# Altium project 全联供输出板_V1.0.PrjPCB
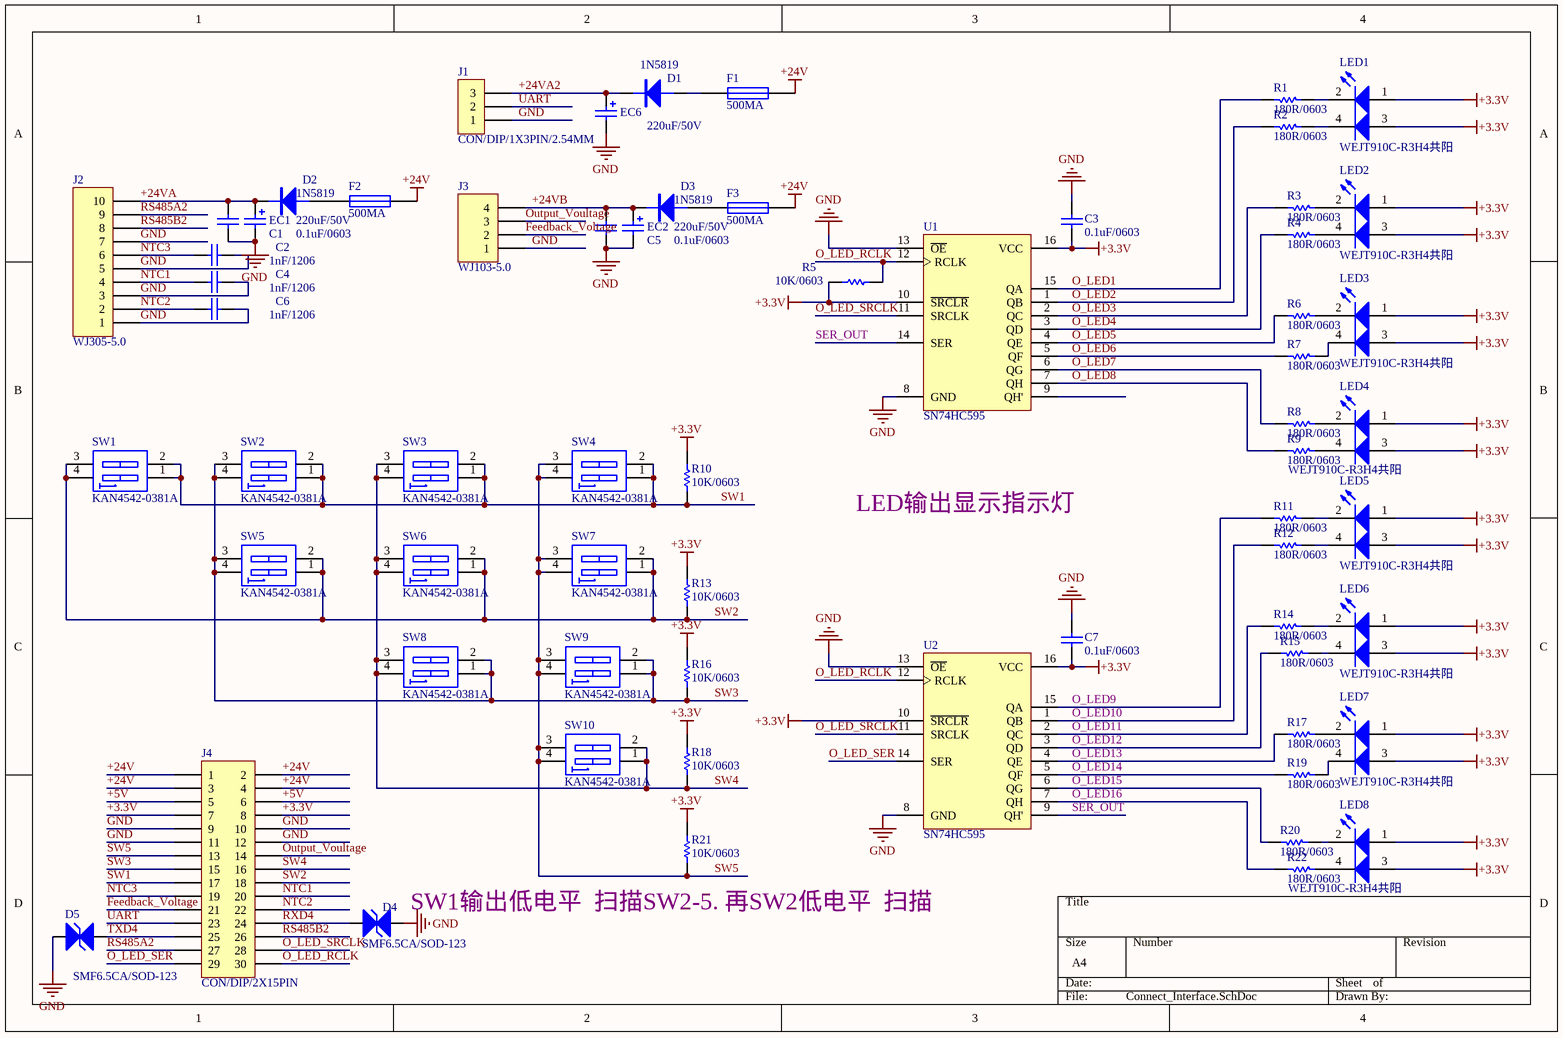
[diagram p0: Connect_Interface.SchDoc]
2 sheets, 105 parts. Net scope: global (net labels, ports and power ports of the same name join across sheets).
Board files: 10515.0461_全联供输出板_V1.1_20200827_1P.PcbDoc, 10515.0461_全联供输出板(2拼版)_V1.0.PcbDoc
Sheets:
  Connect_Interface.SchDoc
  Mini_Comm_sch.SchDoc

## Sheet Connect_Interface.SchDoc
size A4

### Parts
C1  0.1uF/0603  [CAP/SMT/0603C]
C2  1nF/1206  [CAP/SMT/1206C]
C3  0.1uF/0603  [CAP/SMT/0603C]
C4  1nF/1206  [CAP/SMT/1206C]
C5  0.1uF/0603  [CAP/SMT/0603C]
C6  1nF/1206  [CAP/SMT/1206C]
C7  0.1uF/0603  [CAP/SMT/0603C]
D1  1N5819  [D/SMT/DO-214AC]
D2  1N5819  [D/SMT/DO-214AC]
D3  1N5819  [D/SMT/DO-214AC]
D4  SMF6.5CA/SOD-123  [D/SMT/SOD123]
D5  SMF6.5CA/SOD-123  [D/SMT/SOD123]
EC1  220uF/50V  [CAP/SMT/220UF/50V]
EC2  220uF/50V  [CAP/SMT/220UF/50V]
EC6  220uF/50V  [CAP/SMT/220UF/50V]
F1  500MA  [FUSE/100MA/SMC]
F2  500MA  [FUSE/100MA/SMC]
F3  500MA  [FUSE/100MA/SMC]
J1  CON/DIP/1X3PIN/2.54MM  [CON/DIP/1×3PIN/2.54MM/插件端子]
J2  WJ305-5.0  [CON/DIP/1×10PIN/5.0MM/WJ103-10P]
J3  WJ103-5.0  [CON/DIP/1×4PIN/5.0MM/WJ103-4P]
J4  CON/DIP/2X15PIN  [CON/DIP/2X15PIN/2.54MM]
LED1  WEJT910C-R3H4共阳  [D/SMT/WEJT910C-R3H4]
LED2  WEJT910C-R3H4共阳  [D/SMT/WEJT910C-R3H4]
LED3  WEJT910C-R3H4共阳  [D/SMT/WEJT910C-R3H4]
LED4  WEJT910C-R3H4共阳  [D/SMT/WEJT910C-R3H4]
LED5  WEJT910C-R3H4共阳  [D/SMT/WEJT910C-R3H4]
LED6  WEJT910C-R3H4共阳  [D/SMT/WEJT910C-R3H4]
LED7  WEJT910C-R3H4共阳  [D/SMT/WEJT910C-R3H4]
LED8  WEJT910C-R3H4共阳  [D/SMT/WEJT910C-R3H4]
R1  180R/0603  [0603R]
R2  180R/0603  [0603R]
R3  180R/0603  [0603R]
R4  180R/0603  [0603R]
R5  10K/0603  [0603R]
R6  180R/0603  [0603R]
R7  180R/0603  [0603R]
R8  180R/0603  [0603R]
R9  180R/0603  [0603R]
R10  10K/0603  [0603R]
R11  180R/0603  [0603R]
R12  180R/0603  [0603R]
R13  10K/0603  [0603R]
R14  180R/0603  [0603R]
R15  180R/0603  [0603R]
R16  10K/0603  [0603R]
R17  180R/0603  [0603R]
R18  10K/0603  [0603R]
R19  180R/0603  [0603R]
R20  180R/0603  [0603R]
R21  10K/0603  [0603R]
R22  180R/0603  [0603R]
SW1  KAN4542-0381A  [SWITCH/KAN4542]
SW2  KAN4542-0381A  [SWITCH/KAN4542]
SW3  KAN4542-0381A  [SWITCH/KAN4542]
SW4  KAN4542-0381A  [SWITCH/KAN4542]
SW5  KAN4542-0381A  [SWITCH/KAN4542]
SW6  KAN4542-0381A  [SWITCH/KAN4542]
SW7  KAN4542-0381A  [SWITCH/KAN4542]
SW8  KAN4542-0381A  [SWITCH/KAN4542]
SW9  KAN4542-0381A  [SWITCH/KAN4542]
SW10  KAN4542-0381A  [SWITCH/KAN4542]
U1  SN74HC595  [SOP-16]
U2  SN74HC595  [SOP-16]

### Nets
+3.3V: C3.1 C7.1 J4.7 J4.8 LED1.1(A) LED1.3(A) LED2.1(A) LED2.3(A) LED3.1(A) LED3.3(A) LED4.1(A) LED4.3(A) LED5.1(A) LED5.3(A) LED6.1(A) LED6.3(A) LED7.1(A) LED7.3(A) LED8.1(A) LED8.3(A) R5.1 R10.2 R13.2 R16.2 R18.2 R21.2 U1.10(~{SRCLR}) U1.16(VCC) U2.10(~{SRCLR}) U2.16(VCC)
+24V: F1.1 F2.2 F3.2 J4.1 J4.2 J4.3 J4.4
GND: C1.1 C2.2 C3.2 C4.2 C5.1 C6.2 C7.2 D4.2(K) D5.2(K) EC1.2 EC2.2 EC6.2 J1.1 J2.1 J2.3 J2.5 J2.7 J3.1 J4.9 J4.10 J4.11 J4.12 U1.8(GND) U1.13(~{OE}) U2.8(GND) U2.13(~{OE})
+5V: J4.5 J4.6
+24VA: C1.2 D2.1(K) EC1.1 J2.10
+24VA2: D1.1(K) EC6.1 J1.3
+24VB: C5.2 D3.1(K) EC2.1 J3.4
Feedback_Voltage: J3.2 J4.21
NTC1: C4.1 J2.4 J4.20
NTC2: C6.1 J2.2 J4.22
NTC3: C2.1 J2.6 J4.19
O_LED1: R1.1 U1.15(QA)
O_LED2: R2.1 U1.1(QB)
O_LED3: R3.1 U1.2(QC)
O_LED4: R4.1 U1.3(QD)
O_LED5: R6.1 U1.4(QE)
O_LED6: R7.1 U1.5(QF)
O_LED7: R8.1 U1.6(QG)
O_LED8: R9.1 U1.7(QH)
O_LED9: R11.1 U2.15(QA)
O_LED10: R12.1 U2.1(QB)
O_LED11: R14.1 U2.2(QC)
O_LED12: R15.1 U2.3(QD)
O_LED13: R17.1 U2.4(QE)
O_LED14: R19.1 U2.5(QF)
O_LED15: R20.1 U2.6(QG)
O_LED16: R22.1 U2.7(QH)
O_LED_RCLK: J4.30 R5.2 U1.12(RCLK) U2.12(RCLK)
O_LED_SER: J4.29 U2.14(SER)
O_LED_SRCLK: J4.28 U1.11(SRCLK) U2.11(SRCLK)
Output_Voultage: J3.3 J4.14
RS485A2: J2.9 J4.27
RS485B2: J2.8 J4.26
RXD4: D4.1(A) J4.24
SER_OUT: U1.14(SER) U2.9(QH')
SW1: J4.17 R10.1 SW1.1(A1) SW1.2(A2) SW2.1(A1) SW2.2(A2) SW3.1(A1) SW3.2(A2) SW4.1(A1) SW4.2(A2)
SW2: J4.18 R13.1 SW1.3(B2) SW1.4(B1) SW5.1(A1) SW5.2(A2) SW6.1(A1) SW6.2(A2) SW7.1(A1) SW7.2(A2)
SW3: J4.15 R16.1 SW2.3(B2) SW2.4(B1) SW5.3(B2) SW5.4(B1) SW8.1(A1) SW8.2(A2) SW9.1(A1) SW9.2(A2)
SW4: J4.16 R18.1 SW3.3(B2) SW3.4(B1) SW6.3(B2) SW6.4(B1) SW8.3(B2) SW8.4(B1) SW10.1(A1) SW10.2(A2)
SW5: J4.13 R21.1 SW4.3(B2) SW4.4(B1) SW7.3(B2) SW7.4(B1) SW9.3(B2) SW9.4(B1) SW10.3(B2) SW10.4(B1)
TXD4: D5.1(A) J4.25
UART: J1.2 J4.23
NetD1_2: D1.2(A) F1.2
NetD2_2: D2.2(A) F2.1
NetD3_2: D3.2(A) F3.1
NetLED1_2: LED1.2(K) R1.2
NetLED1_4: LED1.4(K) R2.2
NetLED2_2: LED2.2(K) R3.2
NetLED2_4: LED2.4(K) R4.2
NetLED3_2: LED3.2(K) R6.2
NetLED3_4: LED3.4(K) R7.2
NetLED4_2: LED4.2(K) R8.2
NetLED4_4: LED4.4(K) R9.2
NetLED5_2: LED5.2(K) R11.2
NetLED5_4: LED5.4(K) R12.2
NetLED6_2: LED6.2(K) R14.2
NetLED6_4: LED6.4(K) R15.2
NetLED7_2: LED7.2(K) R17.2
NetLED7_4: LED7.4(K) R19.2
NetLED8_2: LED8.2(K) R20.2
NetLED8_4: LED8.4(K) R22.2

Not connected (* = marked no-connect by the designer): U1 9(QH')

### Notes on the sheet
- Labels drawn without touching a wire or pin: LED输出显示指示灯, SW1输出低电平  扫描SW2-5. 再SW2低电平  扫描

### Library data of the parts
C1-C7 = CAP/CAP/SMT/0603C
D1 = D/D/SMT/1N4007/DO-214
D2 D3 = D/D/SMT/1N5819/DO-214
D4 D5 = D/TVS/SMT/SMF13CA/SOD-123
EC1 EC2 EC6 = CAP/AEC/DIP/330uF/25V
F1-F3 = FUSE/PTC/SMT/100MA
J1 = CON/DIP/1X3PIN/2.54MM: Connector
J2 = CON/DIP/1X10PIN/WJ305-5.0: Connector
J3 = CON/DIP/1X4PIN/WJ103-5.0MM: Connector
J4 = CON/DIP/2X15PIN: Connector; LatestRevisionDate: 17-Jul-2002; LatestRevisionNote: Re-released for DXP Platform.; Publisher: Altium Limited
LED1-LED8 = D/LED/DIP/WEJT910C-R3H4-BA共阳
R1-R22 = RES/RES/SMT/0603
SW1-SW10 = SWITCH/TACT/SMT/KAN4542-0381A: 4.5mm*4.5mm*3.8mm
U1 U2 = IC/TTL/SMT/SN74HC595: 8-bit serial-in,serial or parallel-out shift register with output latches;3-state

## Sheet Mini_Comm_sch.SchDoc
size A3
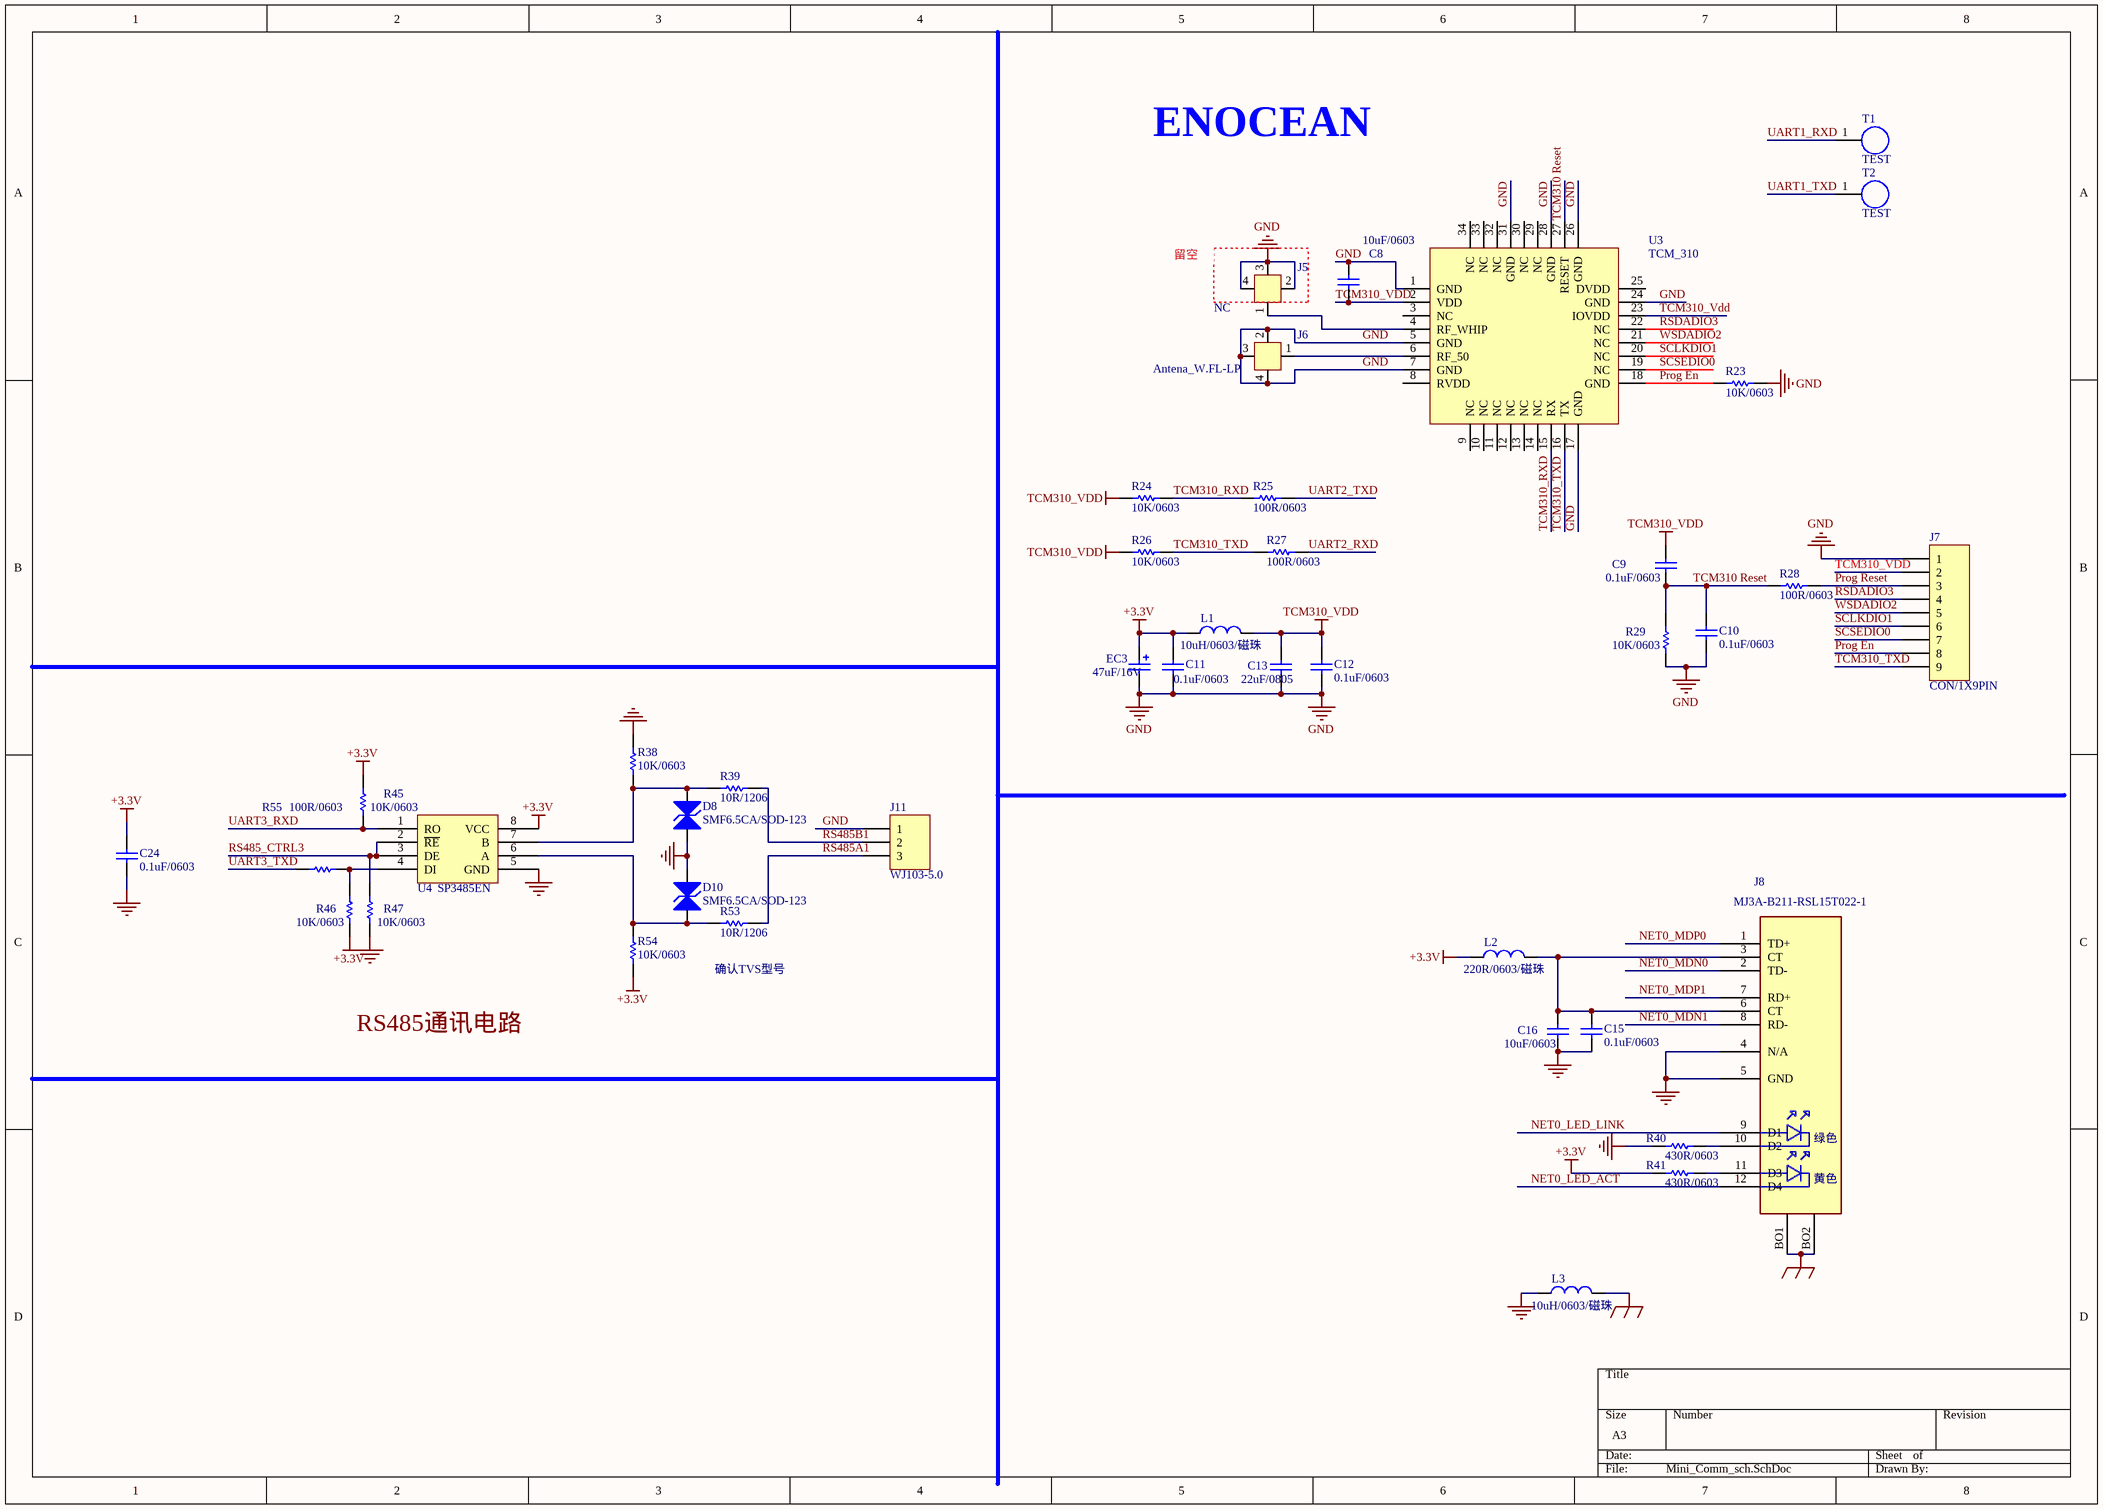
[diagram p1: Mini_Comm_sch.SchDoc]

### Parts
C8  10uF/0603  [CAP/SMT/0603C]
C9  0.1uF/0603  [CAP/SMT/0603C]
C10  0.1uF/0603  [CAP/SMT/0603C]
C11  0.1uF/0603  [CAP/SMT/0603C]
C12  0.1uF/0603  [CAP/SMT/0603C]
C13  22uF/0805  [CAP/SMT/0805C]
C15  0.1uF/0603  [CAP/SMT/0603C]
C16  10uF/0603  [CAP/SMT/0603C]
C24  0.1uF/0603  [CAP/SMT/0603C]
D8  SMF6.5CA/SOD-123  [D/SMT/SOD123]
D10  SMF6.5CA/SOD-123  [D/SMT/SOD123]
EC3  47uF/16V  [CAP/SMT/47uF/16V]
J5  NC  [W.FL.LP-3MM]
J6  Antena_W.FL-LP  [W.FL.LP-3MM]
J7  CON/1X9PIN  [CON/DIP/1×9PIN/1.27MM]
J8  MJ3A-B211-RSL15T022-1  [RJ45-MJ3A-B211-RSL15T022-1]
J11  WJ103-5.0  [CON/DIP/1×3PIN/5.0MM/WJ103-3P]
L1  10uH/0603/磁珠  [0603R]
L2  220R/0603/磁珠  [0603R]
L3  10uH/0603/磁珠  [0603R]
R23  10K/0603  [0603R]
R24  10K/0603  [0603R]
R25  100R/0603  [0603R]
R26  10K/0603  [0603R]
R27  100R/0603  [0603R]
R28  100R/0603  [0603R]
R29  10K/0603  [0603R]
R38  10K/0603  [0603R]
R39  10R/1206  [1206R]
R40  430R/0603  [0603R]
R41  430R/0603  [0603R]
R45  10K/0603  [0603R]
R46  10K/0603  [0603R]
R47  10K/0603  [0603R]
R53  10R/1206  [1206R]
R54  10K/0603  [0603R]
R55  100R/0603  [0603R]
T1  TEST  [TEST]
T2  TEST  [TEST]
U3  TCM_310  [TCM310]
U4  SP3485EN  [SOIC-8]

### Nets
+3.3V: C11.1 C24.2 EC3.1 L1.1 L2.1 R41.2 R45.2 R46.1 R54.2 U4.8(VCC)
EARTH: J8.BO1 J8.BO2 L3.2
GND: C8.2 C10.1 C11.2 C12.1 C13.1 C15.2 C16.1 C24.1 D8.2(K) D10.2(K) EC3.2 J5.2(NC) J5.3(NC) J5.4(NC) J6.2(NC) J6.3(NC) J6.4(NC) J7.1 J8.4(N/A) J8.5(GND) J11.1 L3.1 R23.1 R29.1 R38.1 R40.2 R47.2 U3.1(GND) U3.5(GND) U3.7(GND) U3.17(GND) U3.24(GND) U3.26(GND) U3.28(GND) U3.31(GND) U4.5(GND)
TCM310_Vdd: C8.1 C9.2 C12.2 C13.2 J7.2 L1.2 R24.2 R26.2 U3.2(VDD) U3.23(IOVDD)
NET0_LED_ACT: J8.12(D4)
NET0_LED_LINK: J8.9(D1)
NET0_MDN0: J8.2(TD-)
NET0_MDN1: J8.8(RD-)
NET0_MDP0: J8.1(TD+)
NET0_MDP1: J8.7(RD+)
Prog En: J7.8 R23.2 U3.18(GND)
Prog Reset: J7.3 R28.1
RS485_CTRL3: R47.1 U4.2(~{RE}) U4.3(DE)
RS485A1: J11.3 R53.2
RS485B1: J11.2 R39.2
RSDADIO3: J7.4 U3.22(NC)
SCLKDIO1: J7.6 U3.20(NC)
SCSEDIO0: J7.7 U3.19(NC)
TCM310 Reset: C9.1 C10.2 R28.2 R29.2 U3.27(RESET)
TCM310_RXD: R24.1 R25.2 U3.15(RX)
TCM310_TXD: J7.9 R26.1 R27.2 U3.16(TX)
UART1_RXD: T1.1
UART1_TXD: T2.1
UART2_RXD: R27.1
UART2_TXD: R25.1
UART3_RXD: R45.1 U4.1(RO)
UART3_TXD: R55.2
WSDADIO2: J7.5 U3.21(NC)
NetC15_1: C15.1 C16.2 J8.3(CT) J8.6(CT) L2.2
NetD8_1: D8.1(A) R38.2 R39.1 U4.7(B)
NetD10_1: D10.1(A) R53.1 R54.1 U4.6(A)
NetJ5_1: J5.1(NC) U3.4(RF_WHIP)
NetJ6_1: J6.1(NC) U3.6(RF_50)
NetJ8_10: J8.10(D2) R40.1
NetJ8_11: J8.11(D3) R41.1
NetR46_2: R46.2 R55.1 U4.4(DI)

Not connected (* = marked no-connect by the designer): U3 3(NC) 8(RVDD) 9(NC) 10(NC) 11(NC) 12(NC) 13(NC) 14(NC) 25(DVDD) 29(NC) 30(NC) 32(NC) 33(NC) 34(NC)

### Notes on the sheet
- ENOCEAN
- (near J5) 留空
- 确认TVS型号
- Labels drawn without touching a wire or pin: RS485通讯电路
- (in symbol RJ45B-48F-01GY2DPL2NL) 绿色; 黄色

### Library data of the parts
C8-C12 C15 C16 C24 = CAP/CAP/SMT/0603C
C13 = CAP/CAP/SMT/0805C
D8 D10 = D/TVS/SMT/SMF13CA/SOD-123
EC3 = CAP/AEC/SMT/47uF/16V
J5 J6 = Antena
J7 = CON/DIP/1X9PIN/1.27MM
J8 = RJ45B-48F-01GY2DPL2NL: RJ45 + MAG
J11 = CON/DIP/1X3PIN/WJ103-5.0MM: Connector
L1-L3 = INDUCTOR1
R23-R29 R38 R40 R41 R45-R47 R54 R55 = RES/RES/SMT/0603
R39 R53 = RES/RES/SMT/1206
U4 = SP485EN: MAXIM: *; PackageReference: SOIC8
U3 = TCM_310: PackageReference: *

## Nets that join several sheets
+3.3V: Connect_Interface (30 pins), Mini_Comm_sch (10 pins)
GND: Connect_Interface (26 pins), Mini_Comm_sch (36 pins)